# Altium project NUC.PrjPCB
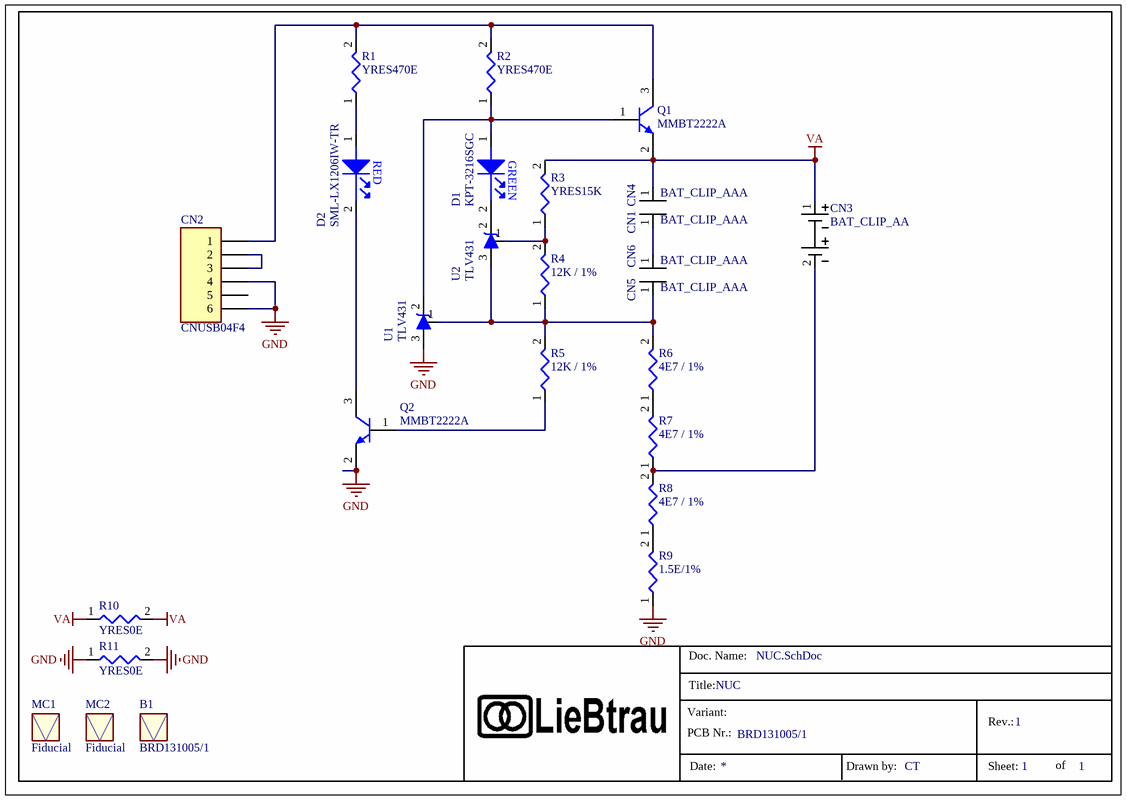
[diagram p0: NUC.SchDoc]
RevisionNr: 1; ProjectName: NUC; PCB_Nr: BRD131005/1; DrawnByX: CT
1 sheet, 26 parts. Net scope: global (net labels, ports and power ports of the same name join across sheets).
Board file: BRD131005.pcbdoc

## Sheet NUC.SchDoc
size 209 x 148 mm; DocumentNumber: 1; SheetNumber: 1; SheetTotal: 1

### Parts
B1  BRD131005/1  [MC_BoardNr]
CN1  BAT_CLIP_AAA  [CN_BAT_CLIP_AAA_Keystone_55]
CN2  CNUSB04F4  [CN_USB_AB_mini]
CN3  BAT_CLIP_AA  [CN_BAT_CLIP_AA_KEYSTONE_2462]
CN4  BAT_CLIP_AAA  [CN_BAT_CLIP_AAA_Keystone_55]
CN5  BAT_CLIP_AAA  [CN_BAT_CLIP_AAA_Keystone_55]
CN6  BAT_CLIP_AAA  [CN_BAT_CLIP_AAA_Keystone_55]
D1  KPT-3216SGC  [DI_LED_1206_G]
D2  SML-LX1206IW-TR  [DI_LED_1206_R]
MC1  Fiducial  [MC_FIDUCIAL]  (no BOM)
MC2  Fiducial  [MC_FIDUCIAL]  (no BOM)
Q1  MMBT2222A  [SC_SOT23]
Q2  MMBT2222A  [SC_SOT23]
R1  YRES470E  [RE_1206]
R2  YRES470E  [RE_1206]
R3  YRES15K  [RE_1206]
R4  12K / 1%  [RE_1206]
R5  12K / 1%  [RE_1206]
R6  4E7 / 1%  [RE_1206]
R7  4E7 / 1%  [RE_1206]
R8  4E7 / 1%  [RE_1206]
R9  1.5E/1%  [RE_1206]
R10  YRES0E  [RE_1206]
R11  YRES0E  [RE_1206]
U1  TLV431  [SC_SOT23]
U2  TLV431  [SC_SOT23]

### Nets
GND: CN2.4 CN2.6 Q2.2(B) R9.1 R11.1 R11.2 U1.3(A)
VA: CN3.1(+) CN4.1 Q1.2(B) R3.2 R10.1 R10.2
NetCN1_1: CN1.1 CN6.1
NetCN2_1: CN2.1 Q1.3(E) R1.2 R2.2
NetCN2_2: CN2.2 CN2.3
NetCN3_2: CN3.2(-) R7.1 R8.2
NetCN5_1: CN5.1 R4.1 R5.2 R6.2 U1.1(Ref) U2.3(A)
NetD1_1: D1.1(A) Q1.1(C) R2.1 U1.2(C)
NetD1_2: D1.2(C) U2.2(C)
NetD2_1: D2.1(A) R1.1
NetD2_2: D2.2(C) Q2.3(E)
NetQ2_1: Q2.1(C) R5.1
NetR3_1: R3.1 R4.2 U2.1(Ref)
NetR6_1: R6.1 R7.2
NetR8_1: R8.1 R9.2

Not connected (* = marked no-connect by the designer): CN2 5

### Notes on the sheet
- Title:
- Doc. Name:
- Variant:
- PCB Nr.:
- Rev.:
- Date:
- Drawn by:
- Sheet:
- of
- (in symbol KPT-3216SGC) GREEN
- (in symbol SML-LX1206IW-TR) RED

### Library data of the parts
B1 = BARE_PCB: Part Number: BARE_PCB; Order Code: BRD131005/1
CN1 CN4-CN6 = BAT_CLIP_AAA: Manufacturer: Keystone; Order Code: Farnell 1702644; Part Number: BAT_CLIP_AAA; Component Type: connector
CN2 = CNUSB04F4: *; Manufacturer: Multicomp; Order Code: Farnell 1696539; Part Number: CNUSB04F4; Component Type: connector
CN3 = BAT_CLIP_AA: Manufacturer: Keystone; Order Code: Farnell 1702630; Part Number: BAT_CLIP_AA; Component Type: connector
D1 = KPT-3216SGC: Manufacturer: Kingbright; Order Code: Farnell 2099247; Part Number: KPT-3216SGC; Component Type: led
D2 = SML-LX1206IW-TR: Manufacturer: LUMEX; Order Code: Farnell 2062231; Part Number: SML-LX1206IW-TR; Component Type: LED
Q1 Q2 = MMBT2222A: Amplifier Transistor NPN Silicon; Manufacturer: Fairchild Semiconductor; Order Code: Farnell 9846700; Part Number: MMBT2222A; Component Type: transistor
R1 R2 = YRES470E: Resistor; Manufacturer: Multicomp; Order Code: Farnell 2074657 / Farnell 2078999; Part Number: YRES470E; Component Type: resistor
R3 = YRES15K: Resistor; Manufacturer: Welwyn; Order Code: Farnell 1100223; Part Number: YRES15K; Component Type: resistor
R4 R5 = RC1206FR-0712KL: Resistor; Manufacturer: YAGEO (PHYCOMP); Order Code: Farnell 9236880 / 1100220; Part Number: RC1206FR-0712KL; Component Type: resistor
R6-R8 = ASC1206-4R7FT5: Resistor; Manufacturer: Welwyn; Order Code: Farnell 2074534/ 2078986; Part Number: ASC1206-4R7FT5; Component Type: resistor
R9 = MCSR12W1R50FTL: Resistor; Manufacturer: Multicomp; Order Code: Farnell 2074533; Part Number: MCSR12W1R50FTL; Component Type: resistor
R10 R11 = YRES0E: Resistor; Manufacturer: Vishay Draloric; Order Code: Farnell 1469963; Part Number: YRES0E; Component Type: resistor
U1 U2 = TLV431: Manufacturer: Diodes Zetex; Order Code: RS 738-5367; Part Number: TLV431; Component Type: voltage reference
MC1 MC2 = Fiducial: Part Number: Fiducial